# Altium project Quark.PrjPCB
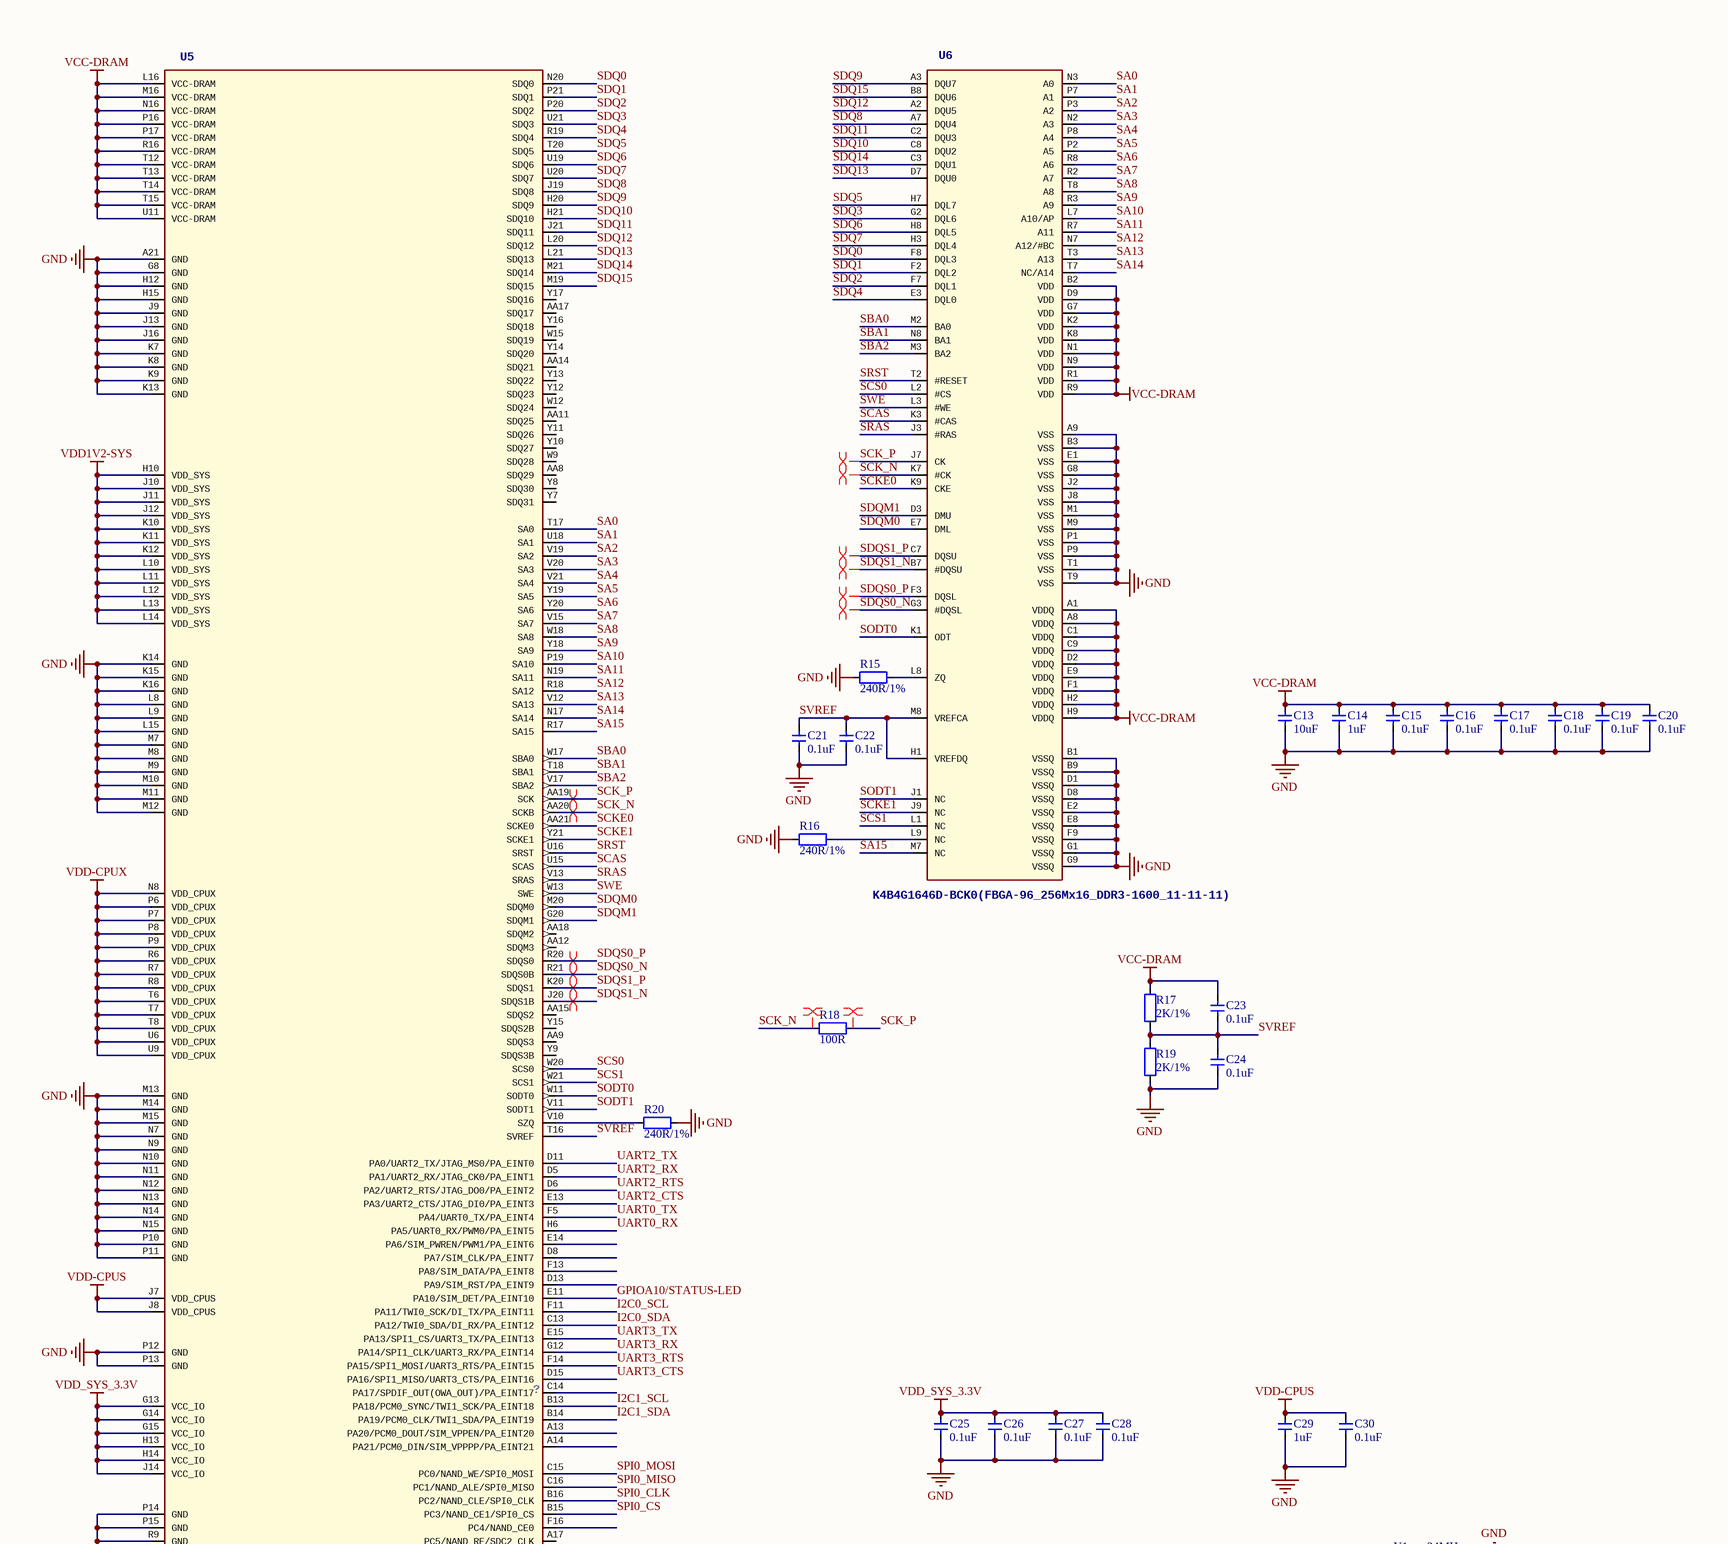
[diagram p0: CPU&DRAM.SchDoc, top]
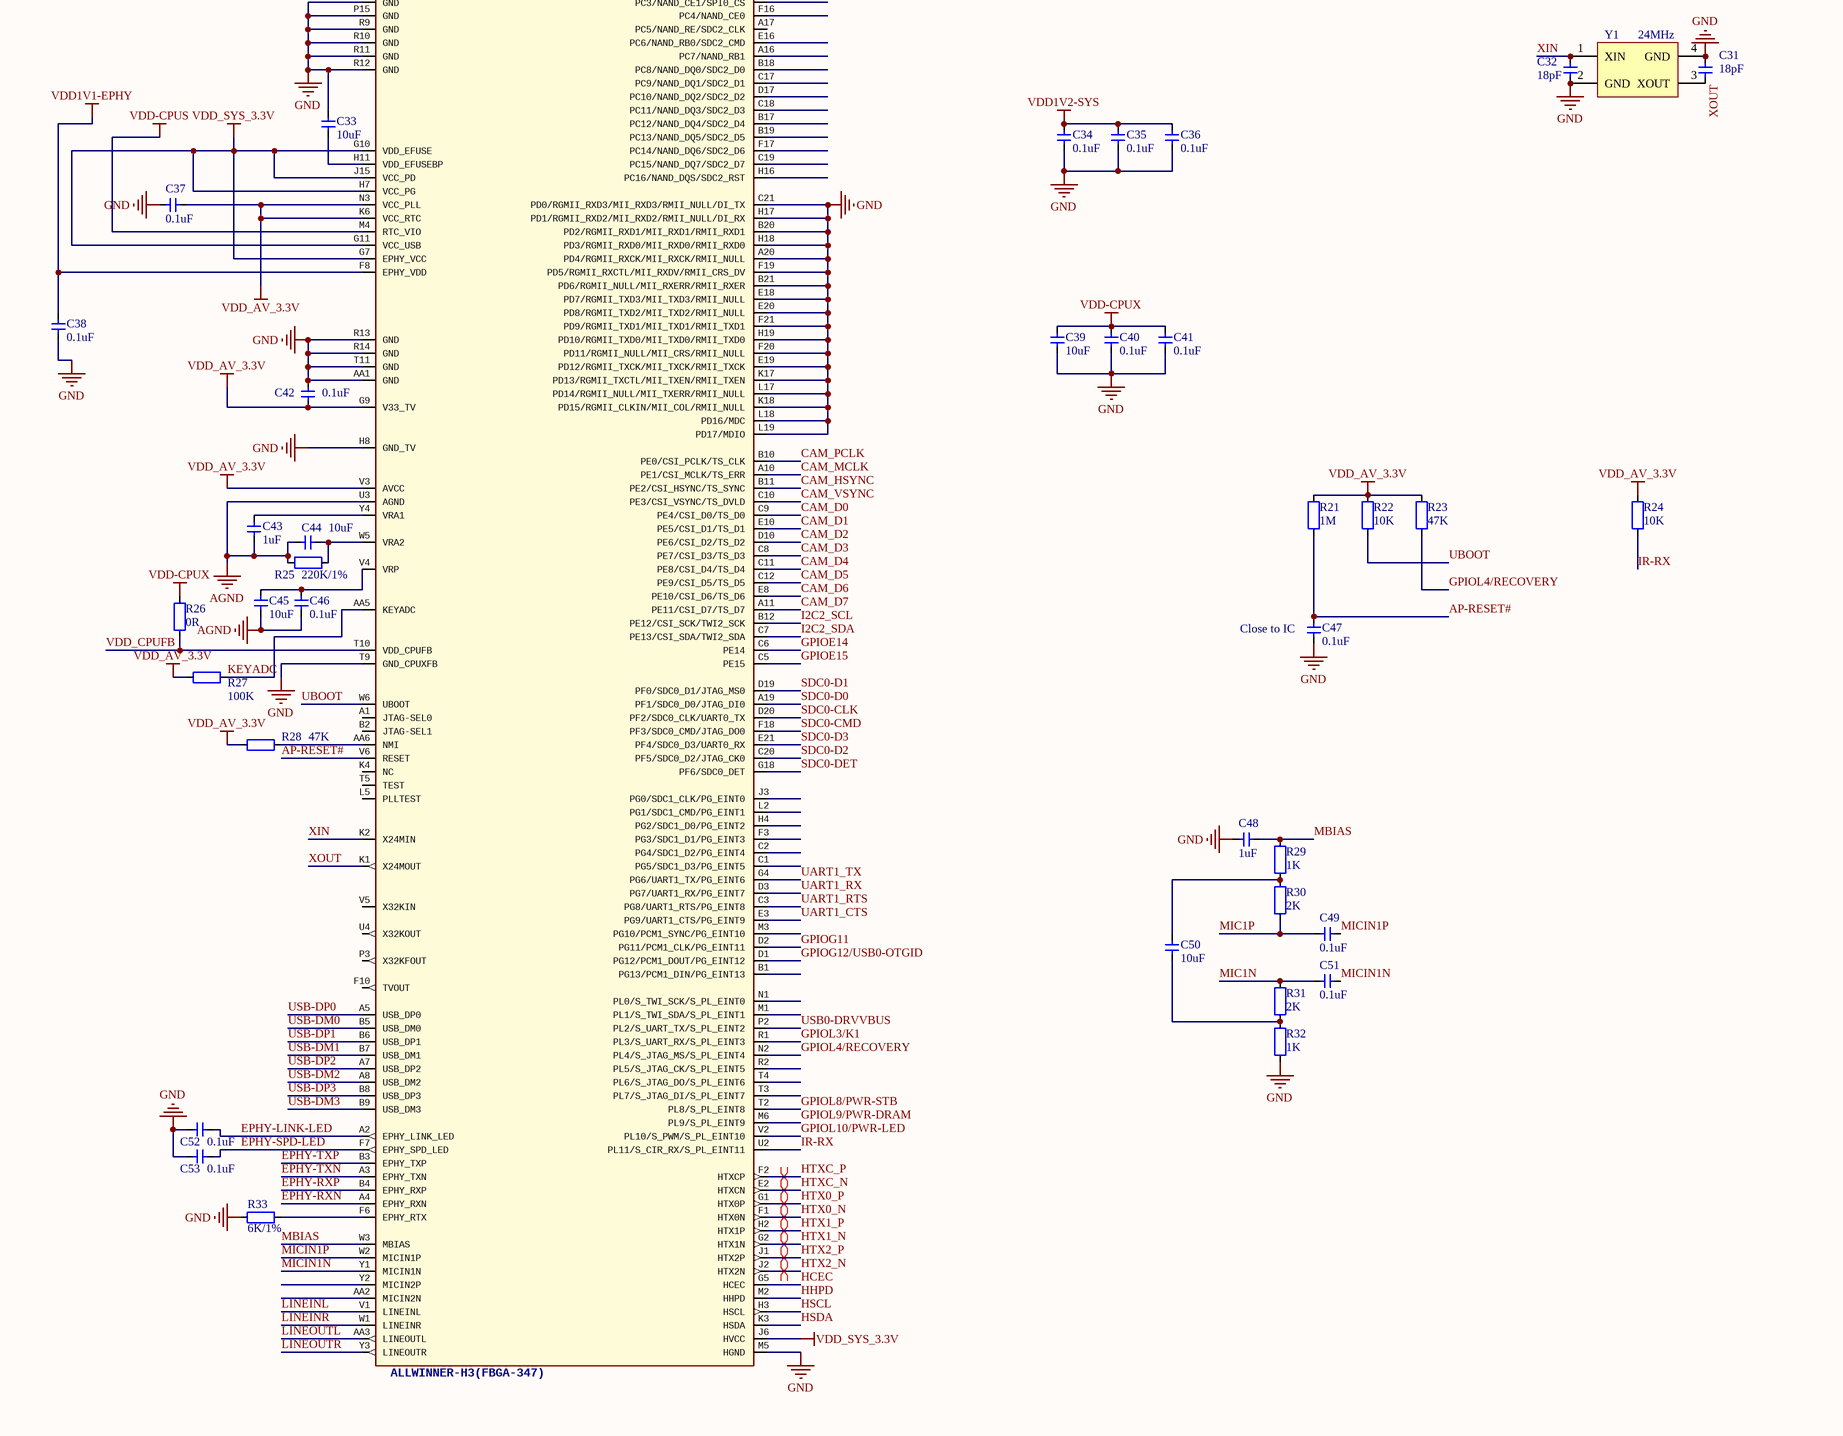
[diagram p1: CPU&DRAM.SchDoc, bottom]
3 sheets, 106 parts. Net scope: global (net labels, ports and power ports of the same name join across sheets).
Board file: Quark.PcbDoc
Sheets:
  CPU&DRAM.SchDoc
  Power.SchDoc
  Connect.SchDoc

## Sheet CPU&DRAM.SchDoc
size 381 x 635 mm

### Parts
C13  10uF  [CAP_0402]
C14  1uF  [CAP_0402]
C15  0.1uF  [CAP_0402]
C16  0.1uF  [CAP_0402]
C17  0.1uF  [CAP_0402]
C18  0.1uF  [CAP_0402]
C19  0.1uF  [CAP_0402]
C20  0.1uF  [CAP_0402]
C21  0.1uF  [CAP_0402]
C22  0.1uF  [CAP_0402]
C23  0.1uF  [CAP_0402]
C24  0.1uF  [CAP_0402]
C25  0.1uF  [CAP_0402]
C26  0.1uF  [CAP_0402]
C27  0.1uF  [CAP_0402]
C28  0.1uF  [CAP_0402]
C29  1uF  [CAP_0402]
C30  0.1uF  [CAP_0402]
C31  18pF  [CAP_0402]
C32  18pF  [CAP_0402]
C33  10uF  [CAP_0402]
C34  0.1uF  [CAP_0402]
C35  0.1uF  [CAP_0402]
C36  0.1uF  [CAP_0402]
C37  0.1uF  [CAP_0402]
C38  0.1uF  [CAP_0402]
C39  10uF  [CAP_0402]
C40  0.1uF  [CAP_0402]
C41  0.1uF  [CAP_0402]
C42  0.1uF  [CAP_0402]
C43  1uF  [CAP_0402]
C44  10uF  [CAP_0402]
C45  10uF  [CAP_0402]
C46  0.1uF  [CAP_0402]
C47  0.1uF  [CAP_0402]
C48  1uF  [CAP_0402]
C49  0.1uF  [CAP_0402]
C50  10uF  [CAP_0402]
C51  0.1uF  [CAP_0402]
C52  0.1uF  [CAP_0402]
C53  0.1uF  [CAP_0402]
R15  240R/1%  [RES_0402]
R16  240R/1%  [RES_0402]
R17  2K/1%  [RES_0402]
R18  100R  [RES_0402]
R19  2K/1%  [RES_0402]
R20  240R/1%  [RES_0402]
R21  1M  [RES_0402]
R22  10K  [RES_0402]
R23  47K  [RES_0402]
R24  10K  [RES_0402]
R25  220K/1%  [RES_0402]
R26  0R  [RES_0402]
R27  100K  [RES_0402]
R28  47K  [RES_0402]
R29  1K  [RES_0402]
R30  2K  [RES_0402]
R31  2K  [RES_0402]
R32  1K  [RES_0402]
R33  6K/1%  [RES_0402]
U5  ALLWINNER-H3(FBGA-347)  [FBGA-347]
U6  K4B4G1646D-BCK0(FBGA-96_256Mx16_DDR3-1600_11-11-11)  [FBGA96(HYNIX_SAMSUNG_512MX16_DDR3)]
Y1  24MHz  [晶振2520]

### Nets
AGND: C43.2 C44.1 C45.1 C46.1 R25.1 U5.U3(AGND)
GND: C13.1 C14.1 C15.1 C16.1 C17.1 C18.1 C19.1 C20.1 C21.1 C22.1 C24.1 C25.1 C26.1 C27.1 C28.1 C29.1 C30.1 C31.2 C32.1 C33.2 C34.1 C35.1 C36.1 C37.2 C38.1 C39.1 C40.1 C41.1 C42.1 C47.1 C48.2 C52.1 C53.1 R15.2 R16.2 R19.1 R20.2 R32.1 R33.1 U5.A20(PD4/RGMII_RXCK/MII_RXCK/RMII_NULL) U5.A21(GND) U5.AA1(GND) U5.B20(PD2/RGMII_RXD1/MII_RXD1/RMII_RXD1) U5.B21(PD6/RGMII_NULL/MII_RXERR/RMII_RXER) U5.C21(PD0/RGMII_RXD3/MII_RXD3/RMII_NULL/DI_TX) U5.E18(PD7/RGMII_TXD3/MII_TXD3/RMII_NULL) U5.E19(PD12/RGMII_TXCK/MII_TXCK/RMII_TXCK) U5.E20(PD8/RGMII_TXD2/MII_TXD2/RMII_NULL) U5.F19(PD5/RGMII_RXCTL/MII_RXDV/RMII_CRS_DV) U5.F20(PD11/RGMII_NULL/MII_CRS/RMII_NULL) U5.F21(PD9/RGMII_TXD1/MII_TXD1/RMII_TXD1) U5.G8(GND) U5.H8(GND_TV) U5.H12(GND) U5.H15(GND) U5.H17(PD1/RGMII_RXD2/MII_RXD2/RMII_NULL/DI_RX) U5.H18(PD3/RGMII_RXD0/MII_RXD0/RMII_RXD0) U5.H19(PD10/RGMII_TXD0/MII_TXD0/RMII_TXD0) U5.J9(GND) U5.J13(GND) U5.J16(GND) U5.K7(GND) U5.K8(GND) U5.K9(GND) U5.K13(GND) U5.K14(GND) U5.K15(GND) U5.K16(GND) U5.K17(PD13/RGMII_TXCTL/MII_TXEN/RMII_TXEN) U5.K18(PD15/RGMII_CLKIN/MII_COL/RMII_NULL) U5.L8(GND) U5.L9(GND) U5.L15(GND) U5.L17(PD14/RGMII_NULL/MII_TXERR/RMII_NULL) U5.L18(PD16/MDC) U5.L19(PD17/MDIO) U5.M5(HGND) U5.M7(GND) U5.M8(GND) U5.M9(GND) U5.M10(GND) U5.M11(GND) U5.M12(GND) U5.M13(GND) U5.M14(GND) U5.M15(GND) U5.N7(GND) U5.N9(GND) U5.N10(GND) U5.N11(GND) U5.N12(GND) U5.N13(GND) U5.N14(GND) U5.N15(GND) U5.P10(GND) U5.P11(GND) U5.P12(GND) U5.P13(GND) U5.P14(GND) U5.P15(GND) U5.R9(GND) U5.R10(GND) U5.R11(GND) U5.R12(GND) U5.R13(GND) U5.R14(GND) U5.T9(GND_CPUXFB) U5.T11(GND) U6.A9(VSS) U6.B1(VSSQ) U6.B3(VSS) U6.B9(VSSQ) U6.D1(VSSQ) U6.D8(VSSQ) U6.E1(VSS) U6.E2(VSSQ) U6.E8(VSSQ) U6.F9(VSSQ) U6.G1(VSSQ) U6.G8(VSS) U6.G9(VSSQ) U6.J2(VSS) U6.J8(VSS) U6.M1(VSS) U6.M9(VSS) U6.P1(VSS) U6.P9(VSS) U6.T1(VSS) U6.T9(VSS) Y1.2(GND) Y1.4(GND)
VCC-DRAM: C13.2 C14.2 C15.2 C16.2 C17.2 C18.2 C19.2 C20.2 C23.2 R17.2 U5.L16(VCC-DRAM) U5.M16(VCC-DRAM) U5.N16(VCC-DRAM) U5.P16(VCC-DRAM) U5.P17(VCC-DRAM) U5.R16(VCC-DRAM) U5.T12(VCC-DRAM) U5.T13(VCC-DRAM) U5.T14(VCC-DRAM) U5.T15(VCC-DRAM) U5.U11(VCC-DRAM) U6.A1(VDDQ) U6.A8(VDDQ) U6.B2(VDD) U6.C1(VDDQ) U6.C9(VDDQ) U6.D2(VDDQ) U6.D9(VDD) U6.E9(VDDQ) U6.F1(VDDQ) U6.G7(VDD) U6.H2(VDDQ) U6.H9(VDDQ) U6.K2(VDD) U6.K8(VDD) U6.N1(VDD) U6.N9(VDD) U6.R1(VDD) U6.R9(VDD)
VDD1V1-EPHY: C38.2 U5.F8(EPHY_VDD)
VDD1V2-SYS: C34.2 C35.2 C36.2 U5.H10(VDD_SYS) U5.J10(VDD_SYS) U5.J11(VDD_SYS) U5.J12(VDD_SYS) U5.K10(VDD_SYS) U5.K11(VDD_SYS) U5.K12(VDD_SYS) U5.L10(VDD_SYS) U5.L11(VDD_SYS) U5.L12(VDD_SYS) U5.L13(VDD_SYS) U5.L14(VDD_SYS)
VDD-CPUS: C29.2 C30.2 U5.J7(VDD_CPUS) U5.J8(VDD_CPUS) U5.M4(RTC_VIO)
VDD-CPUX: C39.2 C40.2 C41.2 R26.2 U5.N8(VDD_CPUX) U5.P6(VDD_CPUX) U5.P7(VDD_CPUX) U5.P8(VDD_CPUX) U5.P9(VDD_CPUX) U5.R6(VDD_CPUX) U5.R7(VDD_CPUX) U5.R8(VDD_CPUX) U5.T6(VDD_CPUX) U5.T7(VDD_CPUX) U5.T8(VDD_CPUX) U5.U6(VDD_CPUX) U5.U9(VDD_CPUX)
VDD_AV_3.3V: C37.1 C42.2 R21.2 R22.2 R23.2 R24.2 R27.1 R28.1 U5.G9(V33_TV) U5.K6(VCC_RTC) U5.N3(VCC_PLL) U5.V3(AVCC)
VDD_SYS_3.3V: C25.2 C26.2 C27.2 C28.2 U5.G7(EPHY_VCC) U5.G10(VDD_EFUSE) U5.G11(VCC_USB) U5.G13(VCC_IO) U5.G14(VCC_IO) U5.G15(VCC_IO) U5.H7(VCC_PG) U5.H13(VCC_IO) U5.H14(VCC_IO) U5.J6(HVCC) U5.J14(VCC_IO) U5.J15(VCC_PD)
AP-RESET#: C47.2 R21.1 U5.V6(RESET)
CAM_D0: U5.C9(PE4/CSI_D0/TS_D0)
CAM_D1: U5.E10(PE5/CSI_D1/TS_D1)
CAM_D2: U5.D10(PE6/CSI_D2/TS_D2)
CAM_D3: U5.C8(PE7/CSI_D3/TS_D3)
CAM_D4: U5.C11(PE8/CSI_D4/TS_D4)
CAM_D5: U5.C12(PE9/CSI_D5/TS_D5)
CAM_D6: U5.E8(PE10/CSI_D6/TS_D6)
CAM_D7: U5.A11(PE11/CSI_D7/TS_D7)
CAM_HSYNC: U5.B11(PE2/CSI_HSYNC/TS_SYNC)
CAM_MCLK: U5.A10(PE1/CSI_MCLK/TS_ERR)
CAM_PCLK: U5.B10(PE0/CSI_PCLK/TS_CLK)
CAM_VSYNC: U5.C10(PE3/CSI_VSYNC/TS_DVLD)
EPHY-LINK-LED: C52.2 U5.A2(EPHY_LINK_LED)
EPHY-RXN: U5.A4(EPHY_RXN)
EPHY-RXP: U5.B4(EPHY_RXP)
EPHY-SPD-LED: C53.2 U5.F7(EPHY_SPD_LED)
EPHY-TXN: U5.A3(EPHY_TXN)
EPHY-TXP: U5.B3(EPHY_TXP)
GPIOA10/STATUS-LED: U5.E11(PA10/SIM_DET/PA_EINT10)
GPIOE14: U5.C6(PE14)
GPIOE15: U5.C5(PE15)
GPIOG11: U5.D2(PG11/PCM1_CLK/PG_EINT11)
GPIOG12/USB0-OTGID: U5.D1(PG12/PCM1_DOUT/PG_EINT12)
GPIOL3/K1: U5.R1(PL3/S_UART_RX/S_PL_EINT3)
GPIOL4/RECOVERY: R23.1 U5.N2(PL4/S_JTAG_MS/S_PL_EINT4)
GPIOL8/PWR-STB: U5.T2(PL8/S_PL_EINT8)
GPIOL9/PWR-DRAM: U5.M6(PL9/S_PL_EINT9)
GPIOL10/PWR-LED: U5.V2(PL10/S_PWM/S_PL_EINT10)
HCEC: U5.G5(HCEC)
HHPD: U5.M2(HHPD)
HSCL: U5.H3(HSCL)
HSDA: U5.K3(HSDA)
HTX0_N: U5.F1(HTX0N)
HTX0_P: U5.G1(HTX0P)
HTX1_N: U5.G2(HTX1N)
HTX1_P: U5.H2(HTX1P)
HTX2_N: U5.J2(HTX2N)
HTX2_P: U5.J1(HTX2P)
HTXC_N: U5.E2(HTXCN)
HTXC_P: U5.F2(HTXCP)
I2C0_SCL: U5.F11(PA11/TWI0_SCK/DI_TX/PA_EINT11)
I2C0_SDA: U5.C13(PA12/TWI0_SDA/DI_RX/PA_EINT12)
I2C1_SCL: U5.B13(PA18/PCM0_SYNC/TWI1_SCK/PA_EINT18)
I2C1_SDA: U5.B14(PA19/PCM0_CLK/TWI1_SDA/PA_EINT19)
I2C2_SCL: U5.B12(PE12/CSI_SCK/TWI2_SCK)
I2C2_SDA: U5.C7(PE13/CSI_SDA/TWI2_SDA)
IR-RX: R24.1 U5.U2(PL11/S_CIR_RX/S_PL_EINT11)
KEYADC: R27.2 U5.AA5(KEYADC)
LINEINL: U5.V1(LINEINL)
LINEINR: U5.W1(LINEINR)
LINEOUTL: U5.AA3(LINEOUTL)
LINEOUTR: U5.Y3(LINEOUTR)
MBIAS: C48.1 R29.2 U5.W3(MBIAS)
MIC1N: C51.2 R31.2
MIC1P: C49.2 R30.1
MICIN1N: C51.1 U5.Y1(MICIN1N)
MICIN1P: C49.1 U5.W2(MICIN1P)
SA0: U5.T17(SA0) U6.N3(A0)
SA1: U5.U18(SA1) U6.P7(A1)
SA2: U5.V19(SA2) U6.P3(A2)
SA3: U5.V20(SA3) U6.N2(A3)
SA4: U5.V21(SA4) U6.P8(A4)
SA5: U5.Y19(SA5) U6.P2(A5)
SA6: U5.Y20(SA6) U6.R8(A6)
SA7: U5.V15(SA7) U6.R2(A7)
SA8: U5.W18(SA8) U6.T8(A8)
SA9: U5.Y18(SA9) U6.R3(A9)
SA10: U5.P19(SA10) U6.L7(A10/AP)
SA11: U5.N19(SA11) U6.R7(A11)
SA12: U5.R18(SA12) U6.N7(A12/#BC)
SA13: U5.V12(SA13) U6.T3(A13)
SA14: U5.N17(SA14) U6.T7(NC/A14)
SA15: U5.R17(SA15) U6.M7(NC)
SBA0: U5.W17(SBA0) U6.M2(BA0)
SBA1: U5.T18(SBA1) U6.N8(BA1)
SBA2: U5.V17(SBA2) U6.M3(BA2)
SCAS: U5.U15(SCAS) U6.K3(#CAS)
SCK_N: R18.1 U5.AA20(SCKB) U6.K7(#CK)
SCK_P: R18.2 U5.AA19(SCK) U6.J7(CK)
SCKE0: U5.AA21(SCKE0) U6.K9(CKE)
SCKE1: U5.Y21(SCKE1) U6.J9(NC)
SCS0: U5.W20(SCS0) U6.L2(#CS)
SCS1: U5.W21(SCS1) U6.L1(NC)
SDC0-CLK: U5.D20(PF2/SDC0_CLK/UART0_TX)
SDC0-CMD: U5.F18(PF3/SDC0_CMD/JTAG_DO0)
SDC0-D0: U5.A19(PF1/SDC0_D0/JTAG_DI0)
SDC0-D1: U5.D19(PF0/SDC0_D1/JTAG_MS0)
SDC0-D2: U5.C20(PF5/SDC0_D2/JTAG_CK0)
SDC0-D3: U5.E21(PF4/SDC0_D3/UART0_RX)
SDC0-DET: U5.G18(PF6/SDC0_DET)
SDQ0: U5.N20(SDQ0) U6.F8(DQL3)
SDQ1: U5.P21(SDQ1) U6.F2(DQL2)
SDQ2: U5.P20(SDQ2) U6.F7(DQL1)
SDQ3: U5.U21(SDQ3) U6.G2(DQL6)
SDQ4: U5.R19(SDQ4) U6.E3(DQL0)
SDQ5: U5.T20(SDQ5) U6.H7(DQL7)
SDQ6: U5.U19(SDQ6) U6.H8(DQL5)
SDQ7: U5.U20(SDQ7) U6.H3(DQL4)
SDQ8: U5.J19(SDQ8) U6.A7(DQU4)
SDQ9: U5.H20(SDQ9) U6.A3(DQU7)
SDQ10: U5.H21(SDQ10) U6.C8(DQU2)
SDQ11: U5.J21(SDQ11) U6.C2(DQU3)
SDQ12: U5.L20(SDQ12) U6.A2(DQU5)
SDQ13: U5.L21(SDQ13) U6.D7(DQU0)
SDQ14: U5.M21(SDQ14) U6.C3(DQU1)
SDQ15: U5.M19(SDQ15) U6.B8(DQU6)
SDQM0: U5.M20(SDQM0) U6.E7(DML)
SDQM1: U5.G20(SDQM1) U6.D3(DMU)
SDQS0_N: U5.R21(SDQS0B) U6.G3(#DQSL)
SDQS0_P: U5.R20(SDQS0) U6.F3(DQSL)
SDQS1_N: U5.J20(SDQS1B) U6.B7(#DQSU)
SDQS1_P: U5.K20(SDQS1) U6.C7(DQSU)
SODT0: U5.W11(SODT0) U6.K1(ODT)
SODT1: U5.V11(SODT1) U6.J1(NC)
SPI0_CLK: U5.B16(PC2/NAND_CLE/SPI0_CLK)
SPI0_CS: U5.B15(PC3/NAND_CE1/SPI0_CS)
SPI0_MISO: U5.C16(PC1/NAND_ALE/SPI0_MISO)
SPI0_MOSI: U5.C15(PC0/NAND_WE/SPI0_MOSI)
SRAS: U5.V13(SRAS) U6.J3(#RAS)
SRST: U5.U16(SRST) U6.T2(#RESET)
SVREF: C21.2 C22.2 C23.1 C24.2 R17.1 R19.2 U5.T16(SVREF) U6.H1(VREFDQ) U6.M8(VREFCA)
SWE: U5.W13(SWE) U6.L3(#WE)
UART0_RX: U5.H6(PA5/UART0_RX/PWM0/PA_EINT5)
UART0_TX: U5.F5(PA4/UART0_TX/PA_EINT4)
UART1_CTS: U5.E3(PG9/UART1_CTS/PG_EINT9)
UART1_RTS: U5.C3(PG8/UART1_RTS/PG_EINT8)
UART1_RX: U5.D3(PG7/UART1_RX/PG_EINT7)
UART1_TX: U5.G4(PG6/UART1_TX/PG_EINT6)
UART2_CTS: U5.E13(PA3/UART2_CTS/JTAG_DI0/PA_EINT3)
UART2_RTS: U5.D6(PA2/UART2_RTS/JTAG_DO0/PA_EINT2)
UART2_RX: U5.D5(PA1/UART2_RX/JTAG_CK0/PA_EINT1)
UART2_TX: U5.D11(PA0/UART2_TX/JTAG_MS0/PA_EINT0)
UART3_CTS: U5.D15(PA16/SPI1_MISO/UART3_CTS/PA_EINT16)
UART3_RTS: U5.F14(PA15/SPI1_MOSI/UART3_RTS/PA_EINT15)
UART3_RX: U5.G12(PA14/SPI1_CLK/UART3_RX/PA_EINT14)
UART3_TX: U5.E15(PA13/SPI1_CS/UART3_TX/PA_EINT13)
UBOOT: R22.1 U5.W6(UBOOT)
USB0-DRVVBUS: U5.P2(PL2/S_UART_TX/S_PL_EINT2)
USB-DM0: U5.B5(USB_DM0)
USB-DM1: U5.B7(USB_DM1)
USB-DM2: U5.A8(USB_DM2)
USB-DM3: U5.B9(USB_DM3)
USB-DP0: U5.A5(USB_DP0)
USB-DP1: U5.B6(USB_DP1)
USB-DP2: U5.A7(USB_DP2)
USB-DP3: U5.B8(USB_DP3)
VDD_CPUFB: R26.1 U5.T10(VDD_CPUFB)
XIN: C32.2 U5.K2(X24MIN) Y1.1(XIN)
XOUT: C31.1 U5.K1(X24MOUT) Y1.3(XOUT)
NetC33_1: C33.1 U5.H11(VDD_EFUSEBP)
NetC43_1: C43.1 U5.Y4(VRA1)
NetC44_2: C44.2 R25.2 U5.W5(VRA2)
NetC45_2: C45.2 C46.2 U5.V4(VRP)
NetC50_1: C50.1 R31.1 R32.2
NetC50_2: C50.2 R29.1 R30.2
NetR15_1: R15.1 U6.L8(ZQ)
NetR16_1: R16.1 U6.L9(NC)
NetR20_1: R20.1 U5.V10(SZQ)
NetR28_2: R28.2 U5.AA6(NMI)
NetR33_2: R33.2 U5.F6(EPHY_RTX)

Not connected (* = marked no-connect by the designer): U5 A1(JTAG-SEL0) A13(PA20/PCM0_DOUT/SIM_VPPEN/PA_EINT20) A14(PA21/PCM0_DIN/SIM_VPPPP/PA_EINT21) A16(PC7/NAND_RB1) A17(PC5/NAND_RE/SDC2_CLK) AA2(MICIN2N) AA8(SDQ29) AA9(SDQS3) AA11(SDQ25) AA12(SDQM3) AA14(SDQ21) AA15(SDQS2) AA17(SDQ17) AA18(SDQM2) B1(PG13/PCM1_DIN/PG_EINT13) B2(JTAG-SEL1) B17(PC12/NAND_DQ4/SDC2_D4) B18(PC8/NAND_DQ0/SDC2_D0) B19(PC13/NAND_DQ5/SDC2_D5) C1(PG5/SDC1_D3/PG_EINT5) C2(PG4/SDC1_D2/PG_EINT4) C14(PA17/SPDIF_OUT(OWA_OUT)/PA_EINT17) C17(PC9/NAND_DQ1/SDC2_D1) C18(PC11/NAND_DQ3/SDC2_D3) C19(PC15/NAND_DQ7/SDC2_D7) D8(PA7/SIM_CLK/PA_EINT7) D13(PA9/SIM_RST/PA_EINT9) D17(PC10/NAND_DQ2/SDC2_D2) E14(PA6/SIM_PWREN/PWM1/PA_EINT6) E16(PC6/NAND_RB0/SDC2_CMD) F3(PG3/SDC1_D1/PG_EINT3) F10(TVOUT) F13(PA8/SIM_DATA/PA_EINT8) F16(PC4/NAND_CE0) F17(PC14/NAND_DQ6/SDC2_D6) H4(PG2/SDC1_D0/PG_EINT2) H16(PC16/NAND_DQS/SDC2_RST) J3(PG0/SDC1_CLK/PG_EINT0) K4(NC) L2(PG1/SDC1_CMD/PG_EINT1) L5(PLLTEST) M1(PL1/S_TWI_SDA/S_PL_EINT1) M3(PG10/PCM1_SYNC/PG_EINT10) N1(PL0/S_TWI_SCK/S_PL_EINT0) P3(X32KFOUT) R2(PL5/S_JTAG_CK/S_PL_EINT5) T3(PL7/S_JTAG_DI/S_PL_EINT7) T4(PL6/S_JTAG_DO/S_PL_EINT6) T5(TEST) U4(X32KOUT) V5(X32KIN) W9(SDQ28) W12(SDQ24) W15(SDQ19) Y2(MICIN2P) Y7(SDQ31) Y8(SDQ30) Y9(SDQS3B) Y10(SDQ27) Y11(SDQ26) Y12(SDQ23) Y13(SDQ22) Y14(SDQ20) Y15(SDQS2B) Y16(SDQ18) Y17(SDQ16)

### Layout directives
differential pair: HTX0_N, HTX0_P, HTX1_N, HTX1_P, HTX2_N, HTX2_P, HTXC_N, HTXC_P, SCK_N, SCK_P, SDQS0_N, SDQS0_P, SDQS1_N, SDQS1_P

### Notes on the sheet
- (near C47) Close to IC

### Library data of the parts
C13-C53 = 电容-0402: Capacitor; Value: 0.1u
R15-R33 = 电阻-0402: Resistor; Value: 22R
U6 = K4B8G1646Q-MYK0(FBGA-96_512MX16_DDR3-1600)
Y1 = 晶振-4Pin-无源: 2520无源; MF: ECS International; MP: ECS-3225S30-240-EN-TR; Package: SMD-6 ECS International; Price: 0.75 USD; Availability: Unavailable; Value: *
U5 = ALLWINNER-H3(FBGA-347): ?: ?

## Sheet Power.SchDoc
size A4
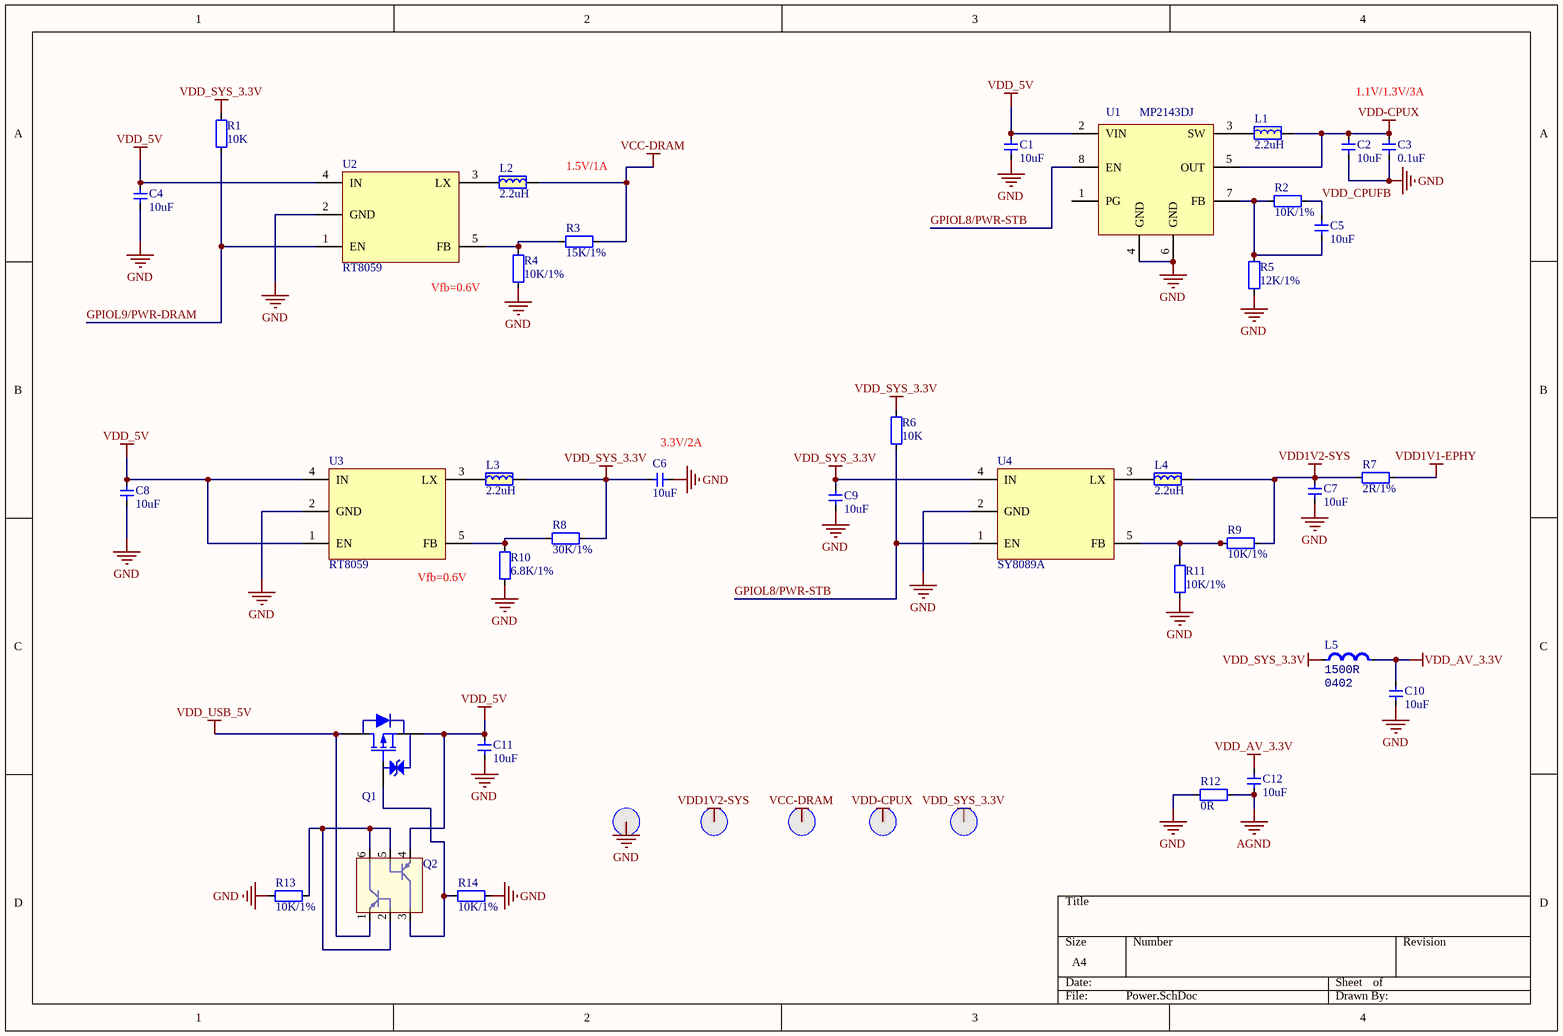
[diagram p2: Power.SchDoc]

### Parts
C1  10uF  [CAP_0402]
C2  10uF  [CAP_0402]
C3  0.1uF  [CAP_0402]
C4  10uF  [CAP_0402]
C5  10uF  [CAP_0402]
C6  10uF  [CAP_0402]
C7  10uF  [CAP_0402]
C8  10uF  [CAP_0402]
C9  10uF  [CAP_0402]
C10  10uF  [CAP_0402]
C11  10uF  [CAP_0402]
C12  10uF  [CAP_0402]
L1  2.2uH  [2520-L]
L2  2.2uH  [2520-L]
L3  2.2uH  [2520-L]
L4  2.2uH  [2520-L]
L5  value 1500R  Type: 0402  [IND_0402]  (hidden comment: H0402)
Q1  AO3415A  [SOT23-3]  (value not drawn)
Q2  BCM856BS  [SOT363-6]  (value not drawn)
R1  10K  [RES_0402]
R2  10K/1%  [RES_0402]
R3  15K/1%  [RES_0402]
R4  10K/1%  [RES_0402]
R5  12K/1%  [RES_0402]
R6  10K  [RES_0402]
R7  2R/1%  [RES_0402]
R8  30K/1%  [RES_0402]
R9  10K/1%  [RES_0402]
R10  6.8K/1%  [RES_0402]
R11  10K/1%  [RES_0402]
R12  0R  [RES_0402]
R13  10K/1%  [RES_0402]
R14  10K/1%  [RES_0402]
T1  测试点  [TEST_PT]  (value not drawn)
T2  测试点  [TEST_PT]  (value not drawn)
T3  测试点  [TEST_PT]  (value not drawn)
T4  测试点  [TEST_PT]  (value not drawn)
T5  测试点  [TEST_PT]  (value not drawn)
U1  MP2143DJ  [SOT23-8]
U2  RT8059  [SOT23-5]
U3  RT8059  [SOT23-5]
U4  SY8089A  [SOT23-5]

### Nets
AGND: C12.1 R12.1
GND: C1.1 C2.1 C3.1 C4.1 C6.1 C7.1 C8.1 C9.1 C10.1 C11.1 R4.1 R5.1 R10.1 R11.1 R12.2 R13.1 R14.2 T1.0 U1.4(GND) U1.6(GND) U2.2(GND) U3.2(GND) U4.2(GND)
VCC-DRAM: L2.2 R3.1 T3.0
VDD1V1-EPHY: R7.2
VDD1V2-SYS: C7.2 L4.2 R7.1 R9.2 T2.0
VDD-CPUX: C2.2 C3.2 L1.2 T4.0 U1.5(OUT)
VDD_5V: C1.2 C4.2 C8.2 C11.2 Q1.2(S) Q2.4 U1.2(VIN) U2.4(IN) U3.1(EN) U3.4(IN)
VDD_AV_3.3V: C10.2 C12.2 L5.2
VDD_SYS_3.3V: C6.2 C9.2 L3.2 L5.1 R1.2 R6.2 R8.1 T5.0 U4.4(IN)
VDD_USB_5V: Q1.3(D) Q2.1
GPIOL8/PWR-STB: R6.1 U1.8(EN) U4.1(EN)
GPIOL9/PWR-DRAM: R1.1 U2.1(EN)
VDD_CPUFB: C5.2 R2.2
NetC5_1: C5.1 R2.1 R5.2 U1.7(FB)
NetL1_1: L1.1 U1.3(SW)
NetL2_1: L2.1 U2.3(LX)
NetL3_1: L3.1 U3.3(LX)
NetL4_1: L4.1 U4.3(LX)
NetQ1_1: Q1.1(G) Q2.3 R14.1
NetQ2_2: Q2.2 Q2.5 Q2.6 R13.2
NetR3_2: R3.2 R4.2 U2.5(FB)
NetR8_2: R8.2 R10.2 U3.5(FB)
NetR9_1: R9.1 R11.2 U4.5(FB)

Not connected (* = marked no-connect by the designer): U1 1(PG)

### Notes on the sheet
- 1.1V/1.3V/3A
- (near L2) 1.5V/1A
- Vfb=0.6V
- (near C6) 3.3V/2A

### Library data of the parts
C1-C12 = 电容-0402: Capacitor; Value: 0.1u
L1-L4 = 电感-2520: 磁珠
L5 = Ind_0402: Inductor; Specification: ±5% 100mA; Manufacturer: *
Q1 = AO3415A: MOSFET; Published: 8-Jun-2000; LatestRevisionDate: 17-Jul-2002; LatestRevisionNote: Re-released for DXP Platform.; PackageVersion: 1995/1996; PackageReference: E3; Publisher: Altium Limited; PackageDescription: TO, Flat Index; 3 In-Line, Axial Leads; Body Dia. 4.6mm; Lead Dia. 0.5 mm (max)
Q2 = BCM856BS: Transistor
R1-R14 = 电阻-0402: Resistor; Value: 22R
U1 = MP2143DJ: LDO
U2 U3 = RT8059: LDO
U4 = SY8089A: LDO

## Sheet Connect.SchDoc
size A4
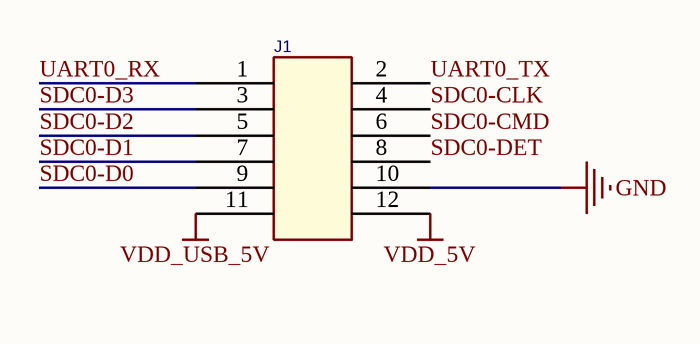
[diagram p3: Connect.SchDoc]

### Parts
J1  MIPI0  [TEST_CORE]  (value not drawn)

### Nets
GND: J1.10
VDD_5V: J1.12
VDD_USB_5V: J1.11
SDC0-CLK: J1.4
SDC0-CMD: J1.6
SDC0-D0: J1.9
SDC0-D1: J1.7
SDC0-D2: J1.5
SDC0-D3: J1.3
SDC0-DET: J1.8
UART0_RX: J1.1
UART0_TX: J1.2

### Library data of the parts
J1 = TEST_12P

## Nets that join several sheets
AGND: CPU&DRAM (6 pins), Power (C12.1 R12.1)
GND: CPU&DRAM (131 pins), Power (23 pins), Connect (J1.10)
VCC-DRAM: CPU&DRAM (39 pins), Power (L2.2 R3.1 T3.0)
VDD1V1-EPHY: CPU&DRAM (C38.2 U5.F8), Power (R7.2)
VDD1V2-SYS: CPU&DRAM (15 pins), Power (5 pins)
VDD-CPUX: CPU&DRAM (17 pins), Power (5 pins)
VDD_5V: Power (10 pins), Connect (J1.12)
VDD_AV_3.3V: CPU&DRAM (12 pins), Power (C10.2 C12.2 L5.2)
VDD_SYS_3.3V: CPU&DRAM (16 pins), Power (9 pins)
VDD_USB_5V: Power (Q1.3 Q2.1), Connect (J1.11)
GPIOL8/PWR-STB: CPU&DRAM (U5.T2), Power (R6.1 U1.8 U4.1)
GPIOL9/PWR-DRAM: CPU&DRAM (U5.M6), Power (R1.1 U2.1)
SDC0-CLK: CPU&DRAM (U5.D20), Connect (J1.4)
SDC0-CMD: CPU&DRAM (U5.F18), Connect (J1.6)
SDC0-D0: CPU&DRAM (U5.A19), Connect (J1.9)
SDC0-D1: CPU&DRAM (U5.D19), Connect (J1.7)
SDC0-D2: CPU&DRAM (U5.C20), Connect (J1.5)
SDC0-D3: CPU&DRAM (U5.E21), Connect (J1.3)
SDC0-DET: CPU&DRAM (U5.G18), Connect (J1.8)
UART0_RX: CPU&DRAM (U5.H6), Connect (J1.1)
UART0_TX: CPU&DRAM (U5.F5), Connect (J1.2)
VDD_CPUFB: CPU&DRAM (R26.1 U5.T10), Power (C5.2 R2.2)